# EAGLE design sensor_A_revA (EAGLE 7.3.0)
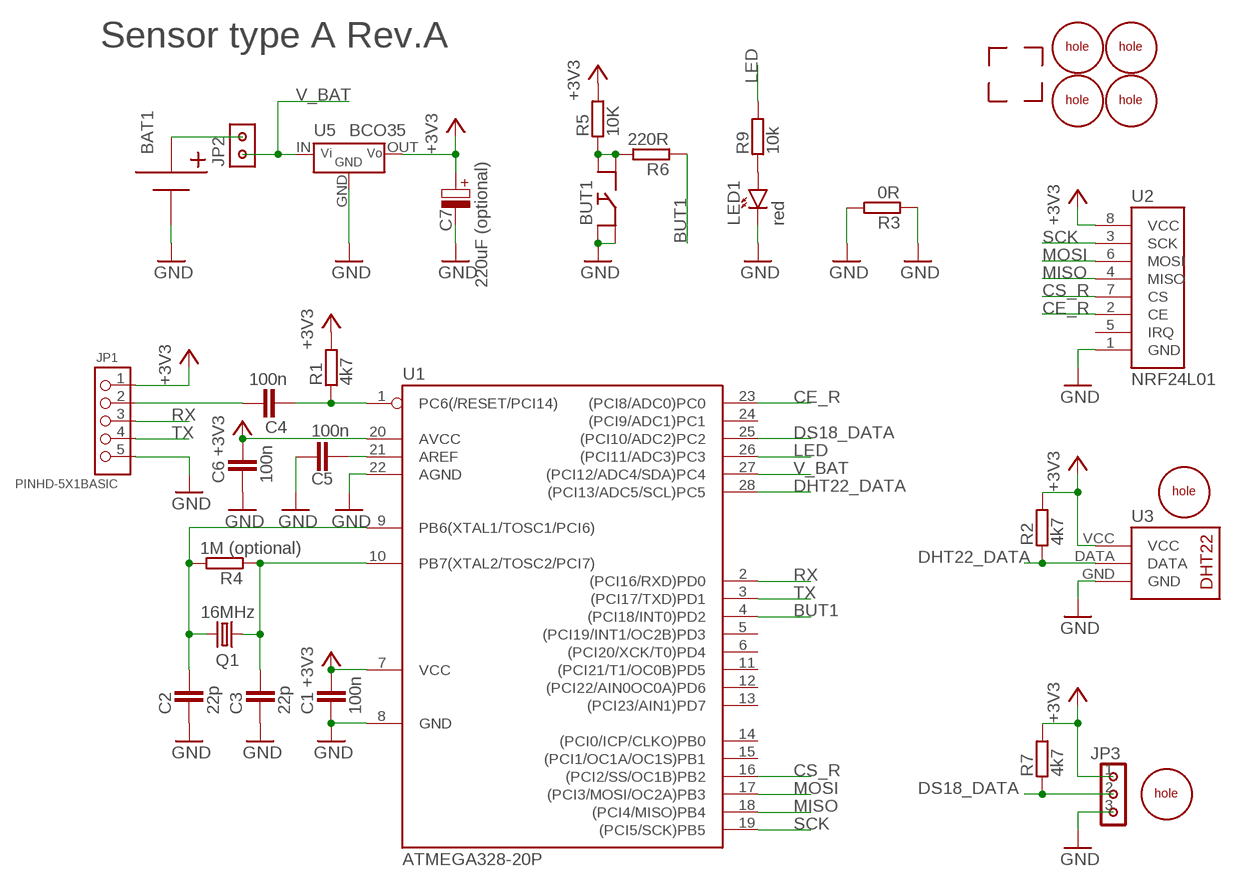
[diagram p0: schematic, sheet 1]

## Parts
BAT1  BATTERY_1X2X1XAAA  [1XAA_BATTERY_HOLDER_DOUBLE]
BUT1  BUTTON'THT'  [BUTTON]
C1  100n  C-CERAMIC'SMD'  [C0805]
C2  22p  C-CERAMIC'SMD'  [C0805]
C3  22p  C-CERAMIC'SMD'  [C0805]
C4  100n  C-CERAMIC'SMD'  [C0805]
C5  100n  C-CERAMIC'SMD'  [C0805]
C6  100n  C-CERAMIC'SMD'  [C0805]
C7  220uF (optional)  C-POLY'6.5MM'  [ELYT-6MM5]
JP1  PINHD-5X1BASIC  [PINHD-5X1]
JP2  PINHD-2X1  [PINHD-2X1]
JP3  PINHD-3X1  [PINHD-3X1]
LED1  red  LED5MM  [LED5MM]
Q1  16MHz  CRYSTALHC49S  [HC49/S]
R1  4k7  R'2'  [R0805]
R2  4k7  R'2'  [R0805]
R3  0R  R'2'  [R0805]
R4  1M (optional)  R'2'  [R0805]
R5  10K  R'2'  [R0805]
R6  220R  R'2'  [R0805]
R7  4k7  R'2'  [R0805]
R9  10k  R'2'  [R0805]
U1  ATMEGA328-20P  [DIL28-3]
U2  NRF24L01  [NRF24L01]
U3  DHT2290  [DHT22/90]
U5  BCO35  STEP_UP-BCO35  [BCO35]
U$1  CORNER  [CORNER]
U$2  CORNER  [CORNER]
U$3  CORNER  [CORNER]
U$4  CORNER  [CORNER]
U$5  HOLE  [HOLE]
U$6  HOLE  [HOLE]
U$7  HOLE  [HOLE]
U$8  HOLE  [HOLE]
U$9  HOLE  [HOLE]
U$10  HOLE  [HOLE]

## Nets
+3V3: C1.2 C6.2 C7.+(POS) JP1.1 JP3.1 R1.2 R2.2 R5.2 R7.2 U1.7(VCC) U1.20(AVCC) U2.8(VCC) U3.VCC U5.OUT(VOUT)
BUT1: R6.1 U1.4((PCI18/INT0)PD2)
CE_R: U1.23((PCI8/ADC0)PC0) U2.2(CE)
CS_R: U1.16((PCI2/SS/OC1B)PB2) U2.7(CS)
DHT22_DATA: R2.1 U1.28((PCI13/ADC5/SCL)PC5) U3.DATA
DS18_DATA: JP3.2 R7.1 U1.25((PCI10/ADC2)PC2)
GND: BAT1.N BAT1.N1(N) BUT1.2 BUT1.4 C1.1 C2.1 C3.1 C5.2 C6.1 C7.-(NEG) JP1.5 JP3.3 LED1.K R3.1 R3.2 U1.8(GND) U1.22(AGND) U2.1(GND) U3.GND U5.GND
LED: R9.2 U1.26((PCI11/ADC3)PC3)
MISO: U1.18((PCI4/MISO)PB4) U2.4(MISO)
MOSI: U1.17((PCI3/MOSI/OC2A)PB3) U2.6(MOSI)
N$1: C3.2 Q1.1 R4.1 U1.10(PB7(XTAL2/TOSC2/PCI7))
N$2: C4.1 R1.1 U1.1(PC6(/RESET/PCI14))
N$4: C2.2 Q1.2 R4.2 U1.9(PB6(XTAL1/TOSC1/PCI6))
N$5: C5.1 U1.21(AREF)
N$6: C4.2 JP1.2
N$8: BAT1.P BAT1.P1(P) JP2.1
N$9: BUT1.1 BUT1.3 R5.1 R6.2
N$11: LED1.A R9.1
RX: JP1.3 U1.2((PCI16/RXD)PD0)
SCK: U1.19((PCI5/SCK)PB5) U2.3(SCK)
TX: JP1.4 U1.3((PCI17/TXD)PD1)
V_BAT: JP2.2 U1.27((PCI12/ADC4/SDA)PC4) U5.IN(VIN)
Unconnected: U1.5((PCI19/INT1/OC2B)PD3) U1.6((PCI20/XCK/T0)PD4) U1.11((PCI21/T1/OC0B)PD5) U1.12((PCI22/AIN0OC0A)PD6) U1.13((PCI23/AIN1)PD7) U1.14((PCI0/ICP/CLKO)PB0) U1.15((PCI1/OC1A/OC1S)PB1) U1.24((PCI9/ADC1)PC1) U2.5(IRQ)

## Notes on the sheet
- Sensor type A Rev.A

## Library data of the parts
BAT1 = 1_domaci:BATTERY_1X
BUT1 = 1_domaci:BUTTON
C1-C6 = 1_domaci:C-CERAMIC
C7 = 1_domaci:C-POLY
JP1 = 1_domaci:PINHD-5X1
JP2 = 1_domaci:PINHD-2X1
JP3 = 1_domaci:PINHD-3X1
LED1 = 1_domaci:LED
Q1 = crystal:CRYSTAL: CRYSTAL; OC_FARNELL: 1667008; OC_NEWARK: unknown
R1-R7 R9 = 1_domaci:R
U1 = 1_domaci:ATMEGA328*P: MICROCONTROLLER 32 kBytes FLASH 2 kBytes SRAM 1 kBytes EEPROM USART 8-channel 10 bit ADC
U2 = 1_domaci:NRF24L01
U3 = 1_domaci:DHT22
U5 = 1_domaci:STEP_UP-BCO35
U$1-U$4 = 1_domaci:CORNER
U$5-U$10 = 1_domaci:HOLE

## Board
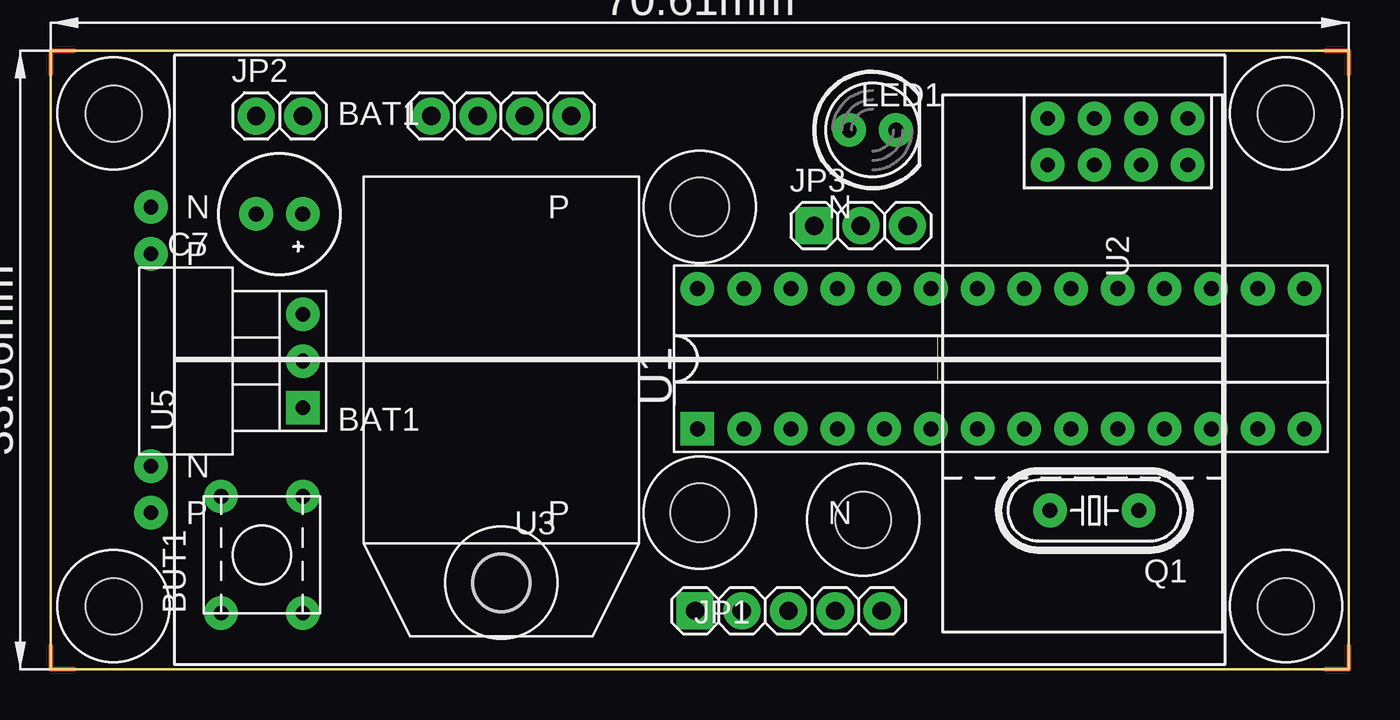
[diagram p1: board, top side]
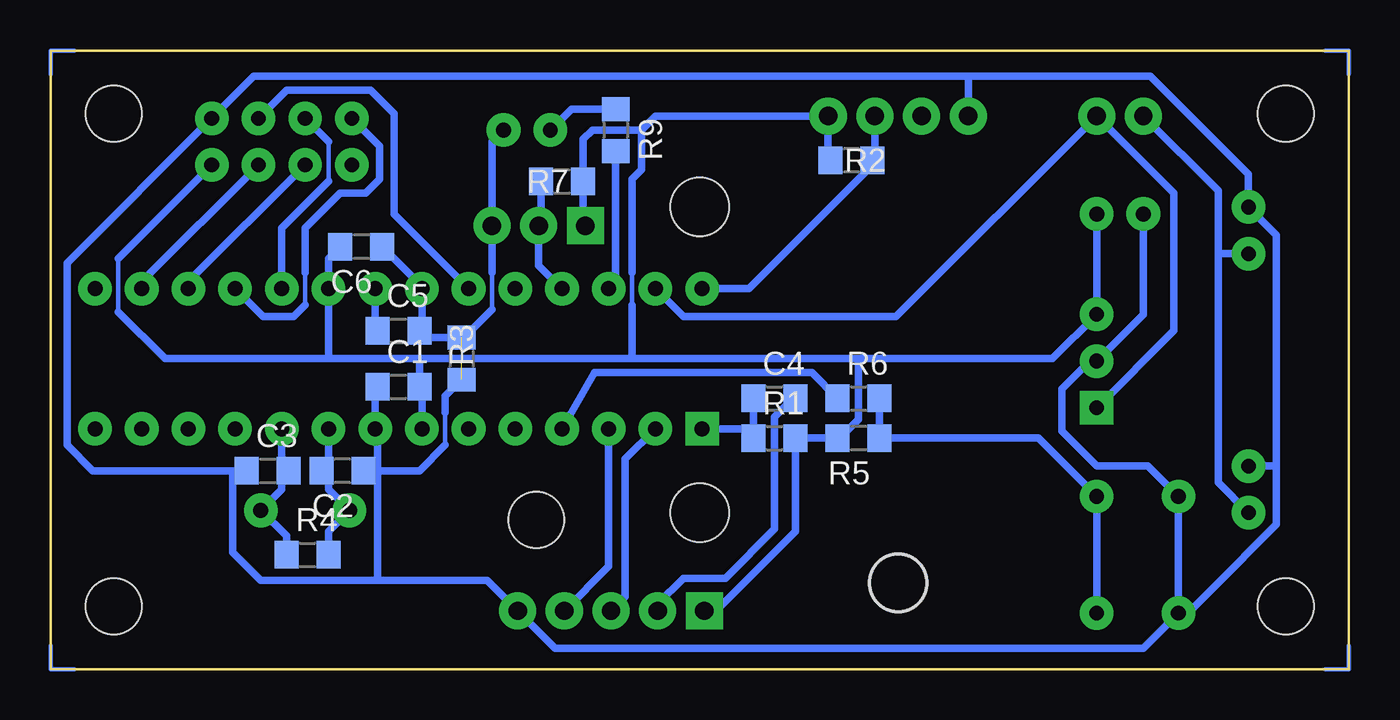
[diagram p2: board, bottom side, seen from below]

Size 70.61 x 33.66 mm. Coordinates in mm from the lower left corner, seen from the top.
Outline: 0,33.66 70.61,33.66 70.61,0 0,0 0,33.66
Copper layers (1*16): Top 0.035mm / dielectric 1.5mm / Bottom 0.035mm
Design rules "default *": minimum track width 10mil, minimum drill 24mil, track to track 8mil, track to pad 8mil, pad to pad 8mil, via to via 8mil, smd to smd 8mil, copper to edge 40mil, drill to drill 8mil, minimum pad ring 20mil, minimum via ring 20mil, stop-mask expansion 4mil, vias tented up to drill 0mil, thermal gap 10mil

### Footprints (pad centres in the part's own frame; a part is rotated, then mirrored left to right if it is on the bottom)
1XAA_BATTERY_HOLDER_DOUBLE = drill 0.8: N -29.845,7.62; N1 -29.845,-6.477; P -29.845,5.08; P1 -29.845,-9.017 | hole 3.2: 0,7.62; 0,-9.017
BUTTON = drill 0.8 pad 1.676: 1 -2.54,-2.54; 2 -2.54,1.905; 3 3.81,-2.54; 4 3.81,1.905
C0805 = smd 1.3 x 1.5: 1 -1.143,0; 2 1.143,0
ELYT-6MM5 = drill 0.813 pad 1.676: + -1.27,0; - 1.27,0
PINHD-5X1 = drill 1 pad 1.676 square: 1 -5.08,0 | drill 1 pad 1.676: 2 -2.54,0; 3 0,0; 4 2.54,0; 5 5.08,0
PINHD-2X1 = drill 1 pad 1.676: 1 -1.27,0; 2 1.27,0
PINHD-3X1 = drill 1 pad 1.676 square: 1 -2.54,0 | drill 1 pad 1.676: 2 0,0; 3 2.54,0
LED5MM = drill 0.813 pad 1.676: A -1.27,0; K 1.27,0
HC49/S = drill 0.813: 1 -2.413,0; 2 2.413,0
R0805 = smd 1.3 x 1.5: 1 -1.143,0; 2 1.143,0
DIL28-3 = drill 0.813 square: 1 -16.51,-3.81 | drill 0.813: 2 -13.97,-3.81; 3 -11.43,-3.81; 4 -8.89,-3.81; 5 -6.35,-3.81; 6 -3.81,-3.81; 7 -1.27,-3.81; 8 1.27,-3.81; 9 3.81,-3.81; 10 6.35,-3.81; 11 8.89,-3.81; 12 11.43,-3.81; 13 13.97,-3.81; 14 16.51,-3.81; 15 16.51,3.81; 16 13.97,3.81; 17 11.43,3.81; 18 8.89,3.81; 19 6.35,3.81; 20 3.81,3.81; 21 1.27,3.81; 22 -1.27,3.81; 23 -3.81,3.81; 24 -6.35,3.81; 25 -8.89,3.81; 26 -11.43,3.81; 27 -13.97,3.81; 28 -16.51,3.81
NRF24L01 = drill 0.8: 1 -1.27,5.08; 2 -1.27,2.54; 3 -1.27,0; 4 -1.27,-2.54; 5 1.27,-2.54; 6 1.27,0; 7 1.27,2.54; 8 1.27,5.08
DHT22/90 = drill 1 pad 1.676: DATA -1.27,0; GND 3.81,0; NC 1.27,0; VCC -3.81,0 | hole 3.2: 0,25.4
BCO35 = drill 0.8: GND 0,0; OUT 2.54,0 | drill 0.8 square: IN -2.54,0
HOLE = hole 3.048: 0,0

### Placement (x,y rotation side)
BAT1  35.31,17.53 0 top
BUT1  11.18,5.59 90 top
C1  51.69,15.37 0 bottom
C2  54.74,10.79 180 bottom
C3  58.8,10.79 0 bottom
C4  31.24,14.73 0 bottom
C5  51.69,18.41 0 bottom
C6  53.72,22.99 180 bottom
C7  12.45,24.77 180 top
JP1  40.13,3.17 0 top
JP2  12.45,30.1 0 top
JP3  44.07,24.13 0 top
LED1  44.7,29.34 0 top
Q1  56.77,8.64 180 top
R1  31.24,12.57 0 bottom
R2  27.05,27.69 180 bottom
R3  48.26,16.89 270 bottom
R4  56.64,6.22 0 bottom
R5  26.67,12.57 180 bottom
R6  26.67,14.73 0 bottom
R7  42.8,26.54 0 bottom
R9  39.88,29.34 270 bottom
U1  51.69,16.89 0 top
U2  56.77,28.7 270 top
U3  24.51,30.1 180 top
U5  13.72,16.76 90 top
U$1  69.98,33.02 180 top
U$2  0.64,0.64 0 top
U$3  0.64,33.02 270 top
U$4  69.98,0.64 90 top
U$5  67.18,3.43 90 top
U$6  67.18,30.23 90 top
U$7  3.43,30.23 90 top
U$8  3.43,3.43 90 top
U$9  24.51,4.7 0 top
U$10  44.2,8.13 0 top

### Tracks (layer width: path | path; a pad name or v marks a point on that pad's centre or on a via)
+3V3
  Bottom 0.254: 38.99,21.59 38.99,19.81 | 66.93,19.43 66.93,22.35
  Bottom 0.406: U1.7 50.42,15.24 C1.2 50.55,16.89 | 66.93,19.43 64.39,16.89 55.5,16.89 | 55.5,16.89 U1.20 55.5,22.35 C6.2 | 55.5,16.89 50.55,16.89 | 50.55,16.89 38.99,16.89 | 38.99,16.89 26.67,16.89 | 26.67,16.89 16.13,16.89 U5.OUT C7.+ | U2.8 66.93,22.35 | 26.67,16.89 26.67,13.59 27.69,12.57 R5.2 R1.2 30.1,7.49 34.42,3.17 JP1.1 | R2.2 28.32,27.81 U3.VCC 37.72,30.1 38.48,29.34 | 38.48,29.34 41.15,29.34 41.66,28.83 R7.2 41.66,24.26 JP3.1 | 38.48,29.34 38.48,27.18 38.99,26.67 38.99,21.59 | 38.99,16.89 38.99,19.81
BUT1
  Bottom 0.406: U1.4 41.02,16.13 29.21,16.13 R6.1
CE_R
  Bottom 0.406: U2.2 57.78,31.5 53.21,31.5 51.94,30.23 51.94,24.77 U1.23
CS_R
  Bottom 0.406: U2.7 65.66,21.08 U1.16
DHT22_DATA
  Bottom 0.406: U3.DATA 25.78,27.81 R2.1 25.91,27.43 32.64,20.7 U1.28
DS18_DATA
  Bottom 0.406: U1.25 44.07,21.97 JP3.2 43.94,24.26 R7.1
GND  (1 unrouted)
  Bottom 0.254: 46.61,21.59 46.61,19.56 | 49.15,13.97 49.15,12.19
  Bottom 0.406: BUT1.2 BUT1.4 10.92,11.05 13.72,11.05 15.62,12.95 15.62,15.24 14.1,16.76 U5.GND 11.18,19.3 C7.- | C1.1 52.96,15.11 U1.8 52.83,12.83 52.83,10.79 | BAT1.N1 3.94,11.05 | 3.94,11.05 3.94,7.87 7.49,4.32 8.76,3.05 BUT1.2 | 3.94,11.05 3.94,23.62 BAT1.N 5.46,26.92 10.79,32.26 20.7,32.26 | 46.61,19.56 48.13,18.03 R3.1 50.16,18.03 C5.2 50.42,18.54 U1.22 50.42,20.83 C6.1 | 52.83,10.79 52.83,10.67 | 52.83,10.67 52.83,4.83 | C3.1 60.71,10.79 | 60.71,10.79 68.33,10.79 69.72,12.19 69.72,22.1 U2.1 59.56,32.26 20.7,32.26 | 60.71,10.79 60.71,6.35 59.18,4.83 52.83,4.83 | C2.1 52.96,10.79 52.83,10.67 | R3.2 49.15,14.86 49.15,13.97 | 49.15,12.19 50.55,10.79 52.83,10.79 | U3.GND 20.7,32.26 | BUT1.2 11.18,1.14 43.18,1.14 JP1.5 46.86,4.83 52.83,4.83 | 46.61,21.59 JP3.3 46.61,28.7 LED1.K
LED
  Bottom 0.406: U1.26 39.88,21.08 R9.2
MISO
  Bottom 0.254: 56.77,21.59 56.77,19.81
  Bottom 0.406: U2.4 52.7,28.45 52.7,26.67 53.47,25.91 54.86,25.91 56.77,24 56.77,21.59 | 56.77,19.81 57.4,19.18 59.05,19.18 U1.18
MOSI
  Bottom 0.406: U2.6 63.12,21.08 U1.17
N$1
  Bottom 0.406: U1.10 58.04,11.18 C3.2 57.66,10.67 58.04,10.29 58.04,9.78 Q1.1 57.78,7.24 R4.1
N$2
  Bottom 0.406: C4.1 32.38,13.08 | 32.38,13.08 R1.1 | U1.1 32.38,13.08
N$4
  Bottom 0.406: U1.9 55.5,11.18 C2.2 55.88,10.67 55.5,10.29 55.5,9.78 Q1.2 55.5,7.49 R4.2
N$5
  Bottom 0.406: U1.21 52.96,18.54 C5.1
N$6
  Bottom 0.406: JP1.2 37.59,3.56 36.2,4.95 33.91,4.95 31.24,7.62 31.24,13.72 30.23,14.73 C4.2
N$8
  Bottom 0.406: 7.11,22.61 7.11,26.04 JP2.1 | 7.11,22.61 7.11,10.16 BAT1.P1 | BAT1.P 7.11,22.61
N$9
  Bottom 0.406: BUT1.1 BUT1.3 16.89,12.57 R5.1 R6.2
N$11
  Bottom 0.406: R9.1 42.29,30.48 LED1.A
RX
  Bottom 0.406: U1.2 39.37,11.43 39.37,3.94 JP1.3
SCK
  Bottom 0.254: 55.5,28.7 55.5,26.54
  Bottom 0.406: U2.3 55.5,28.7 | 55.5,26.54 58.04,24 U1.19
TX
  Bottom 0.406: U1.3 40.26,5.59 JP1.4
V_BAT
  Bottom 0.406: U5.IN 9.53,18.41 9.53,25.91 JP2.2 24.64,19.18 36.2,19.18 U1.27